# Altium schematic sheet LEDS.SchDoc
size A; SheetNumber: 4; SheetTotal: 9
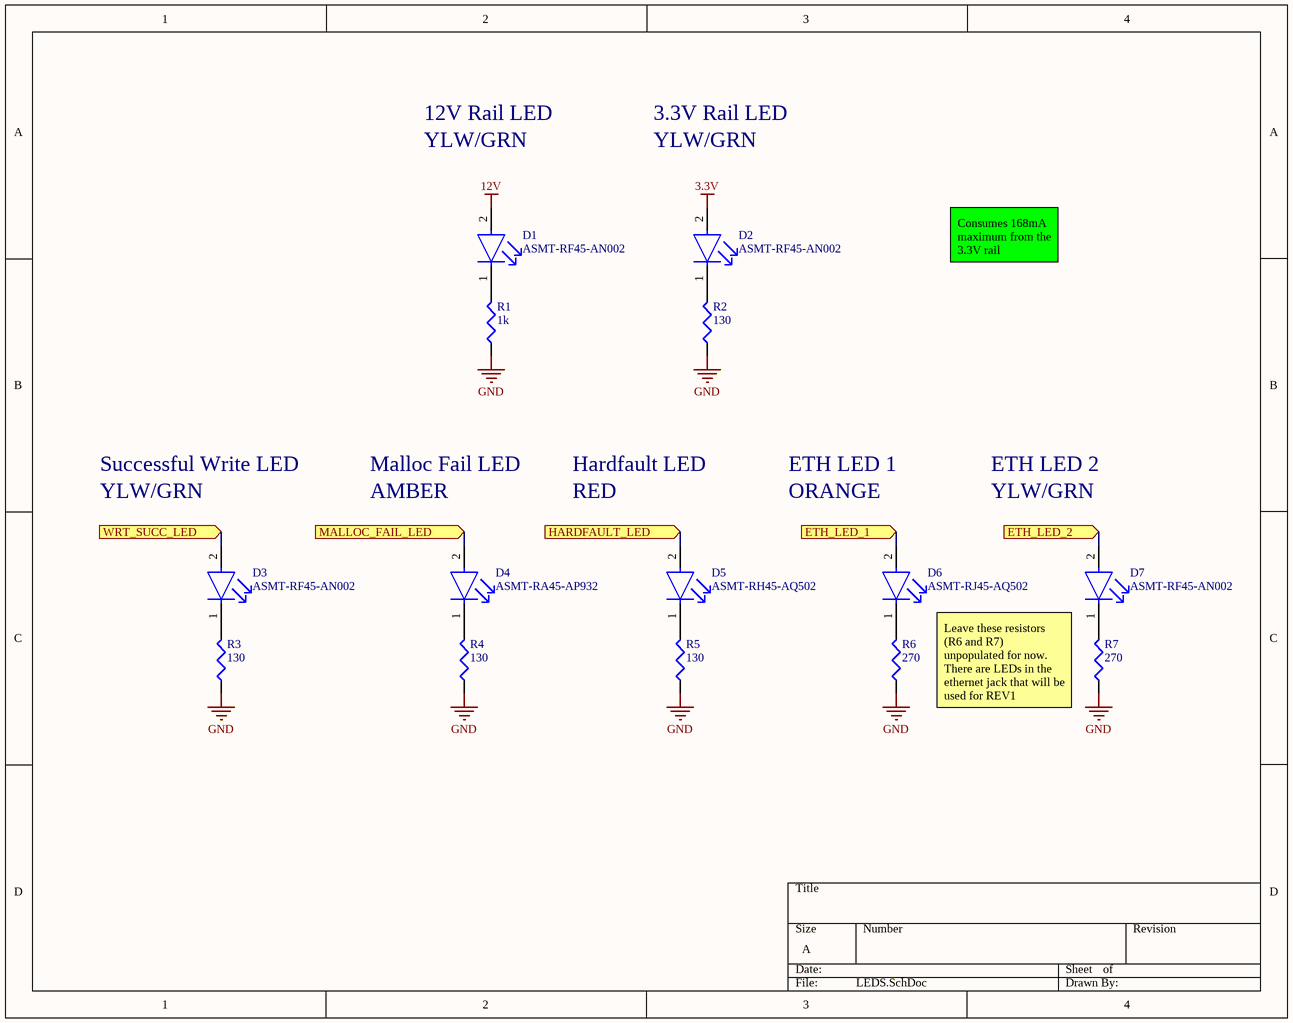
[diagram p0: LEDS.SchDoc]

## Parts
D1  ASMT-RF45-AN002  [FP-ASMT-RF45-AN002-MFG]
D2  ASMT-RF45-AN002  [FP-ASMT-RF45-AN002-MFG]
D3  ASMT-RF45-AN002  [FP-ASMT-RF45-AN002-MFG]
D4  ASMT-RA45-AP932  [FP-ASMT-RF45-AN002-MFG]
D5  ASMT-RH45-AQ502  [FP-ASMT-RF45-AN002-MFG]
D6  ASMT-RJ45-AQ502  [FP-ASMT-RF45-AN002-MFG]
D7  ASMT-RF45-AN002  [FP-ASMT-RF45-AN002-MFG]
R1  1k  [J1-0603]
R2  130  [J1-0603]
R3  130  [J1-0603]
R4  130  [J1-0603]
R5  130  [J1-0603]
R6  270  [J1-0603]
R7  270  [J1-0603]

## Ports
ETH_LED_1 (in), ETH_LED_2 (in), HARDFAULT_LED (in), MALLOC_FAIL_LED (in), WRT_SUCC_LED (in)

## Nets
3.3V: D2.2(A)
12V: D1.2(A)
GND: R1.1 R2.1 R3.1 R4.1 R5.1 R6.1 R7.1
ETH_LED_1: D6.2(A) ; port ETH_LED_1
ETH_LED_2: D7.2(A) ; port ETH_LED_2
HARDFAULT_LED: D5.2(A) ; port HARDFAULT_LED
MALLOC_FAIL_LED: D4.2(A) ; port MALLOC_FAIL_LED
WRT_SUCC_LED: D3.2(A) ; port WRT_SUCC_LED
NetD1_1: D1.1(C) R1.2
NetD2_1: D2.1(C) R2.2
NetD3_1: D3.1(C) R3.2
NetD4_1: D4.1(C) R4.2
NetD5_1: D5.1(C) R5.2
NetD6_1: D6.1(C) R6.2
NetD7_1: D7.1(C) R7.2

## Notes on the sheet
- 12V Rail LED
- YLW/GRN
- 3.3V Rail LED
- Consumes 168mA maximum from the 3.3V rail
- Successful Write LED
- Malloc Fail LED
- AMBER
- Hardfault LED
- RED
- ETH LED 1
- ORANGE
- ETH LED 2
- Leave these resistors (R6 and R7) unpopulated for now. There are LEDs in the ethernet jack that will be used for REV1

## Library data of the parts
D1-D3 D7 = CMP-2000-05796-2: LED YLW/GREEN DIFFUSED 0603 SMD; Manufacturer: Broadcom; Viewing Angle: 145°; Reverse Voltage: 5V; Luminous Intensity: 60mcd; Forward Voltage: 2V; Colour: Yellow Green; Wavelength: 573nm; Forward Current: 20mA; Led Orientation: Top View; Max Junction Temp: +110°C; Peak Emmision Wavelength: 574nm; Power Dissipation: 48mW; RoHS: TRUE; Category: Diode; Height: 0.55mm; Package: ASMT-RF45-AN002; Device Class L1: Optoelectronics; Temperature: -40°C to +100°C; ComponentLink2URL: https://docs.broadcom.com/docs/AV02-0378EN; Mouser Description: LED; SMD; 0603; yellow green; 28-60mcd; 1.6x0.8x0.45mm; 145°; 20mA; Temperature Range High: +100°C; Temperature Range Low: -40°C; Octopart: https://octopart.com/asmt-rf45-an002-broadcom-71127304; Lead Free: Yes; ComponentLink2Description: Datasheet; Device Class L2: LEDs; Manufacturer Part Number: ASMT-RF45-AN002; Digikey Description: LED YLW/GREEN DIFFUSED 0603 SMD; Automotive: No; Device Class L3: unset
D4 = CMP-2000-05796-2: LED AMBER DIFFUSED SMD; Manufacturer: Broadcom; Manufacturer Part Number: ASMT-RF45-AN002; Viewing Angle: 145°; Reverse Voltage: 5V; Luminous Intensity: 60mcd; Forward Voltage: 2V; Colour: Yellow Green; Wavelength: 573nm; Forward Current: 20mA; Led Orientation: Top View; Max Junction Temp: +110°C; Peak Emmision Wavelength: 574nm; Power Dissipation: 48mW; RoHS: TRUE; Category: Diode; Height: 0.55mm; Package: ASMT-RF45-AN002; Device Class L1: Optoelectronics; Temperature: -40°C to +100°C; ComponentLink2URL: https://docs.broadcom.com/docs/AV02-0378EN; Mouser Description: LED; SMD; 0603; yellow green; 28-60mcd; 1.6x0.8x0.45mm; 145°; 20mA; Temperature Range High: +100°C; Temperature Range Low: -40°C; Octopart: https://octopart.com/asmt-rf45-an002-broadcom-71127304; Lead Free: Yes; ComponentLink2Description: Datasheet; Device Class L2: LEDs; Digikey Description: LED YLW/GREEN DIFFUSED 0603 SMD; Automotive: No; Device Class L3: unset
D5 = CMP-2000-05796-2: LED RED DIFFUSED 0603 SMD; Manufacturer: Broadcom; Manufacturer Part Number: ASMT-RF45-AN002; Viewing Angle: 145°; Reverse Voltage: 5V; Luminous Intensity: 60mcd; Forward Voltage: 2V; Colour: Yellow Green; Wavelength: 573nm; Forward Current: 20mA; Led Orientation: Top View; Max Junction Temp: +110°C; Peak Emmision Wavelength: 574nm; Power Dissipation: 48mW; RoHS: TRUE; Category: Diode; Height: 0.55mm; Package: ASMT-RF45-AN002; Device Class L1: Optoelectronics; Temperature: -40°C to +100°C; ComponentLink2URL: https://docs.broadcom.com/docs/AV02-0378EN; Mouser Description: LED; SMD; 0603; yellow green; 28-60mcd; 1.6x0.8x0.45mm; 145°; 20mA; Temperature Range High: +100°C; Temperature Range Low: -40°C; Octopart: https://octopart.com/asmt-rf45-an002-broadcom-71127304; Lead Free: Yes; ComponentLink2Description: Datasheet; Device Class L2: LEDs; Digikey Description: LED YLW/GREEN DIFFUSED 0603 SMD; Automotive: No; Device Class L3: unset
D6 = CMP-2000-05796-2: LED ORANGE DIFFUSED 0603 SMD; Manufacturer: Broadcom; Manufacturer Part Number: ASMT-RF45-AN002; Viewing Angle: 145°; Reverse Voltage: 5V; Luminous Intensity: 60mcd; Forward Voltage: 2V; Colour: Yellow Green; Wavelength: 573nm; Forward Current: 20mA; Led Orientation: Top View; Max Junction Temp: +110°C; Peak Emmision Wavelength: 574nm; Power Dissipation: 48mW; RoHS: TRUE; Category: Diode; Height: 0.55mm; Package: ASMT-RF45-AN002; Device Class L1: Optoelectronics; Temperature: -40°C to +100°C; ComponentLink2URL: https://docs.broadcom.com/docs/AV02-0378EN; Mouser Description: LED; SMD; 0603; yellow green; 28-60mcd; 1.6x0.8x0.45mm; 145°; 20mA; Temperature Range High: +100°C; Temperature Range Low: -40°C; Octopart: https://octopart.com/asmt-rf45-an002-broadcom-71127304; Lead Free: Yes; ComponentLink2Description: Datasheet; Device Class L2: LEDs; Digikey Description: LED YLW/GREEN DIFFUSED 0603 SMD; Automotive: No; Device Class L3: unset
R1-R7 = Res3: Resistor; Published: 8-Jun-2000; LatestRevisionDate: 29-May-2009; LatestRevisionNote: IPC-7351 Footprint Added.; PackageReference: J1-0603; Publisher: Altium Limited; PackageDescription: Chip Resistor
  R1: Value: 1K
  R2-R5: Value: 130
  R6 R7: Value: 270